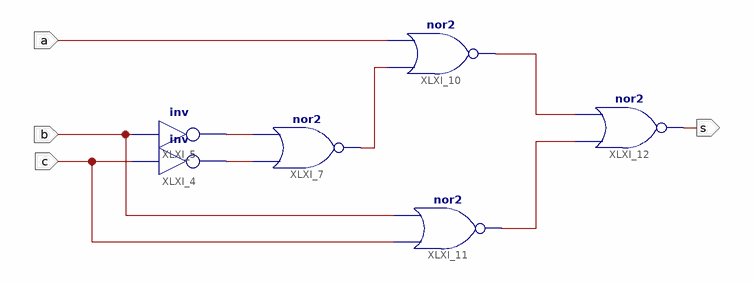
[diagram p0: schematic sheet 1]
// Xilinx ISE schematic circuit2.sch (spartan3e) as structural Verilog: 6 symbols, 4 ports
module circuit2 (
  input  a,
  input  b,
  input  c,
  output s
);

  wire XLXN_1, XLXN_2, XLXN_3, XLXN_5, XLXN_6;

  not XLXI_4 (XLXN_2, c);
  not XLXI_5 (XLXN_1, b);
  nor XLXI_7 (XLXN_3, XLXN_2, XLXN_1);
  nor XLXI_10 (XLXN_5, XLXN_3, a);
  nor XLXI_11 (XLXN_6, c, b);
  nor XLXI_12 (s, XLXN_6, XLXN_5);
endmodule
